# EAGLE design COUNT (EAGLE 7.2.0)
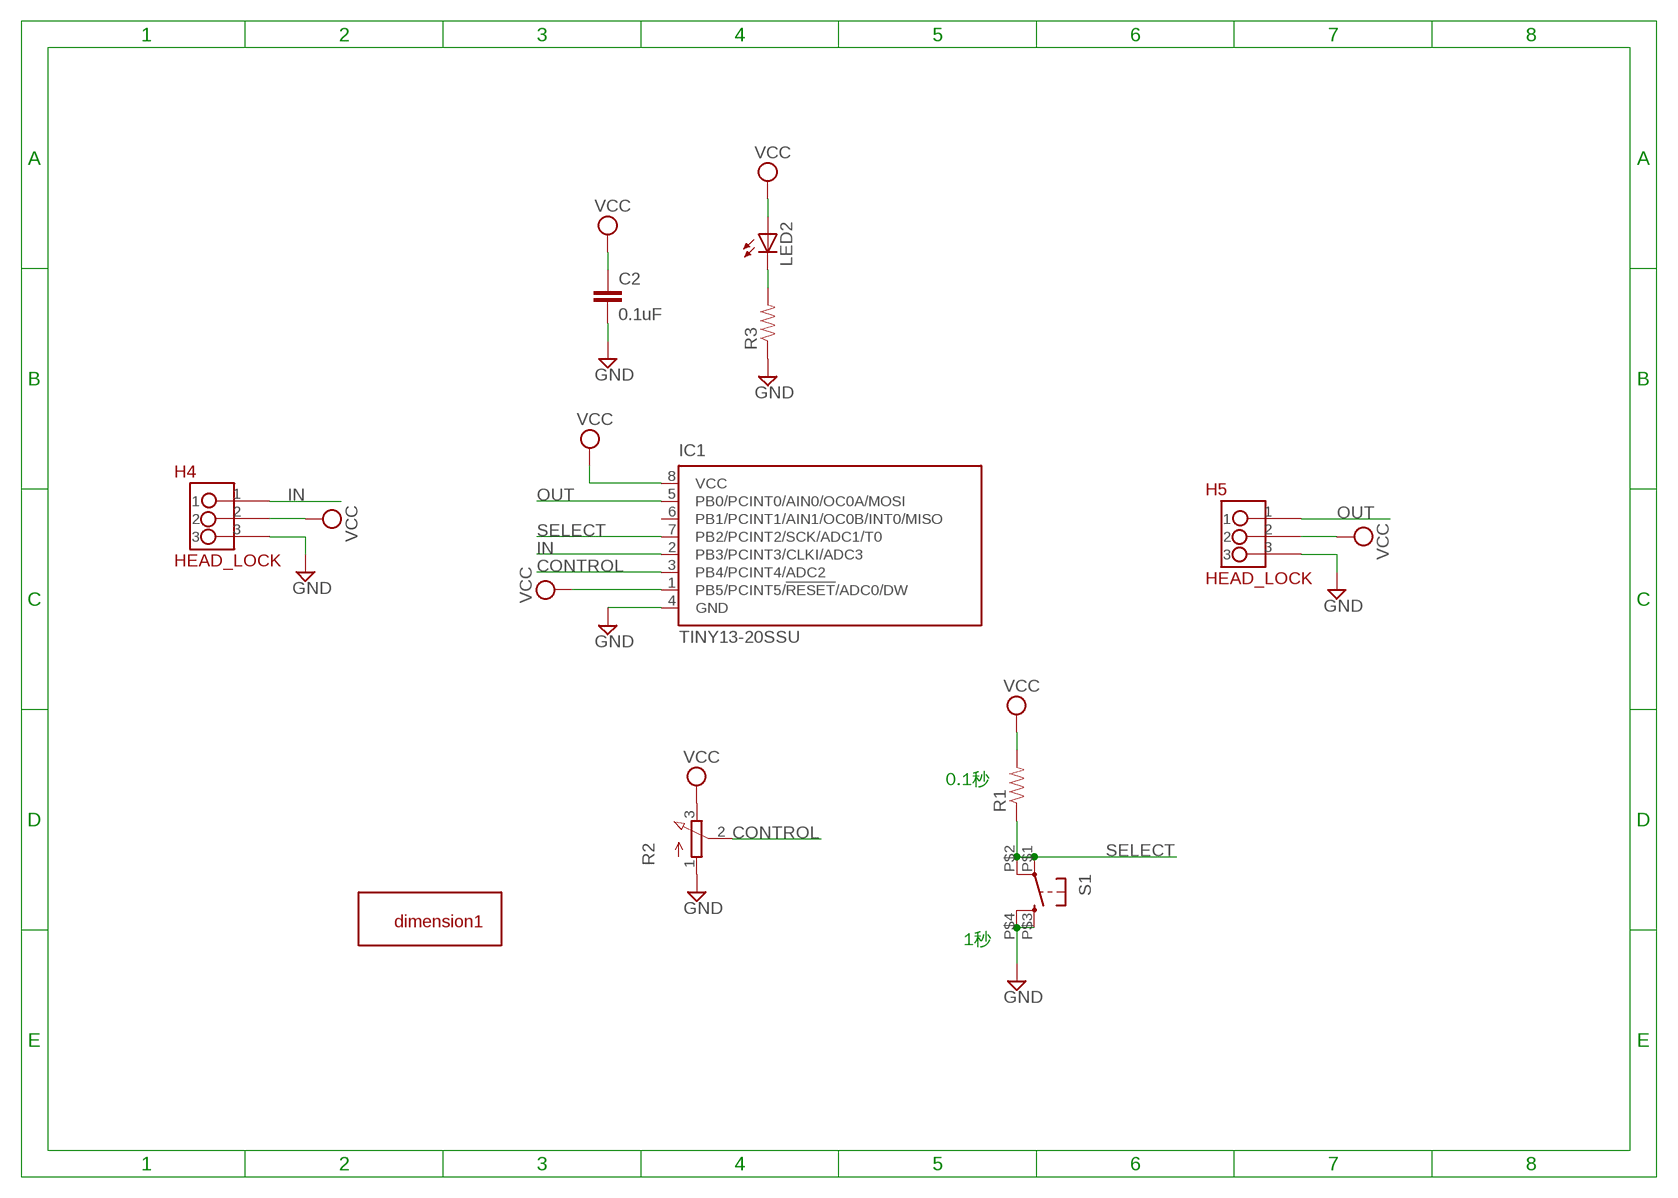
[diagram p0: schematic, sheet 1]

## Parts
C2  0.1uF  CAP0603-CAP  [0603-CAP]
H4  HEAD_LOCK  [HEAD_LOCK]
H5  HEAD_LOCK  [HEAD_LOCK]
IC1  TINY13-20SSU  [8S1]
LED2  LED_ESML0603  [LED_SML0603]
R1  RESISTOR0603-RES  [0603-RES]
R2  3RP/1610N  [3RP/1610N]
R3  0.27OHM-1/10W-1%(0603)  [0603-RES]
S1  TAC_SWITCHKSA_SEALED  [KSA_SEALED_TAC_SWITCH]
U$1  DIMENSION1  [DIMENSION1]

## Nets
CONTROL: IC1.3(PB4/PCINT4/ADC2) R2.2(S)
GND: C2.2 H4.3 H5.3 IC1.4(GND) R2.1(A) R3.1 S1.P$3 S1.P$4
IN: H4.1 IC1.2(PB3/PCINT3/CLKI/ADC3)
N$2: LED2.C R3.2
OUT: H5.1 IC1.5(PB0/PCINT0/AIN0/OC0A/MOSI)
SELECT: IC1.7(PB2/PCINT2/SCK/ADC1/T0) R1.1 S1.P$1 S1.P$2
VCC: C2.1 H4.2 H5.2 IC1.1(PB5/PCINT5/!RESET!/ADC0/DW) IC1.8(VCC) LED2.A R1.2 R2.3(E)
Unconnected: IC1.6(PB1/PCINT1/AIN1/OC0B/INT0/MISO)

## Notes on the sheet
- 0.1秒
- 1秒

## Library data of the parts
C2 = SparkFun-Passives:CAP: Capacitor Standard 0603 ceramic capacitor, and 0.1" leaded capacitor.
H4 H5 = HEAD_LOCK:HEAD_LOCK: 带锁的排座
IC1 = atmel:TINY13: 8-bit AVR Microcontroller with 1K Bytes In-System Programmable Flash Source: http://www.atmel.com/dyn/resources/prod_documents/2535S.pdf; MPN: ATTINY13-20SSU; OC_FARNELL: 1455133; OC_NEWARK: 58M3771
LED2 = eagle-ltspice:LED_E: LED Source: http://www.osram.convergy.de Source: www.luxeon.com Source: www.kingbright.com; SPICEMODEL: NONE; SPICEPREFIX: D; SPICETYPE: diode
R1 = SparkFun-Passives:RESISTOR: Resistor Basic schematic elements and footprints for 0603, 1206, and PTH resistors.
R2 = pot:3RP/1610N: 16mm Potentiometer one level Source: http://www.alphapotentiometers.net/html/16mm_pot_2.html
R3 = SparkFun-Resistors:0.27OHM-1/10W-1%(0603): RES-08787; PROD_ID: RES-08787
S1 = SparkFun-Retired:TAC_SWITCH: Momentary Switch Button commonly used for reset or general input. Spark Fun Electronics SKU : COM-00097 SMT- SWCH-08247
U$1 = Xmaker_yuhui:DIMENSION1

## Board
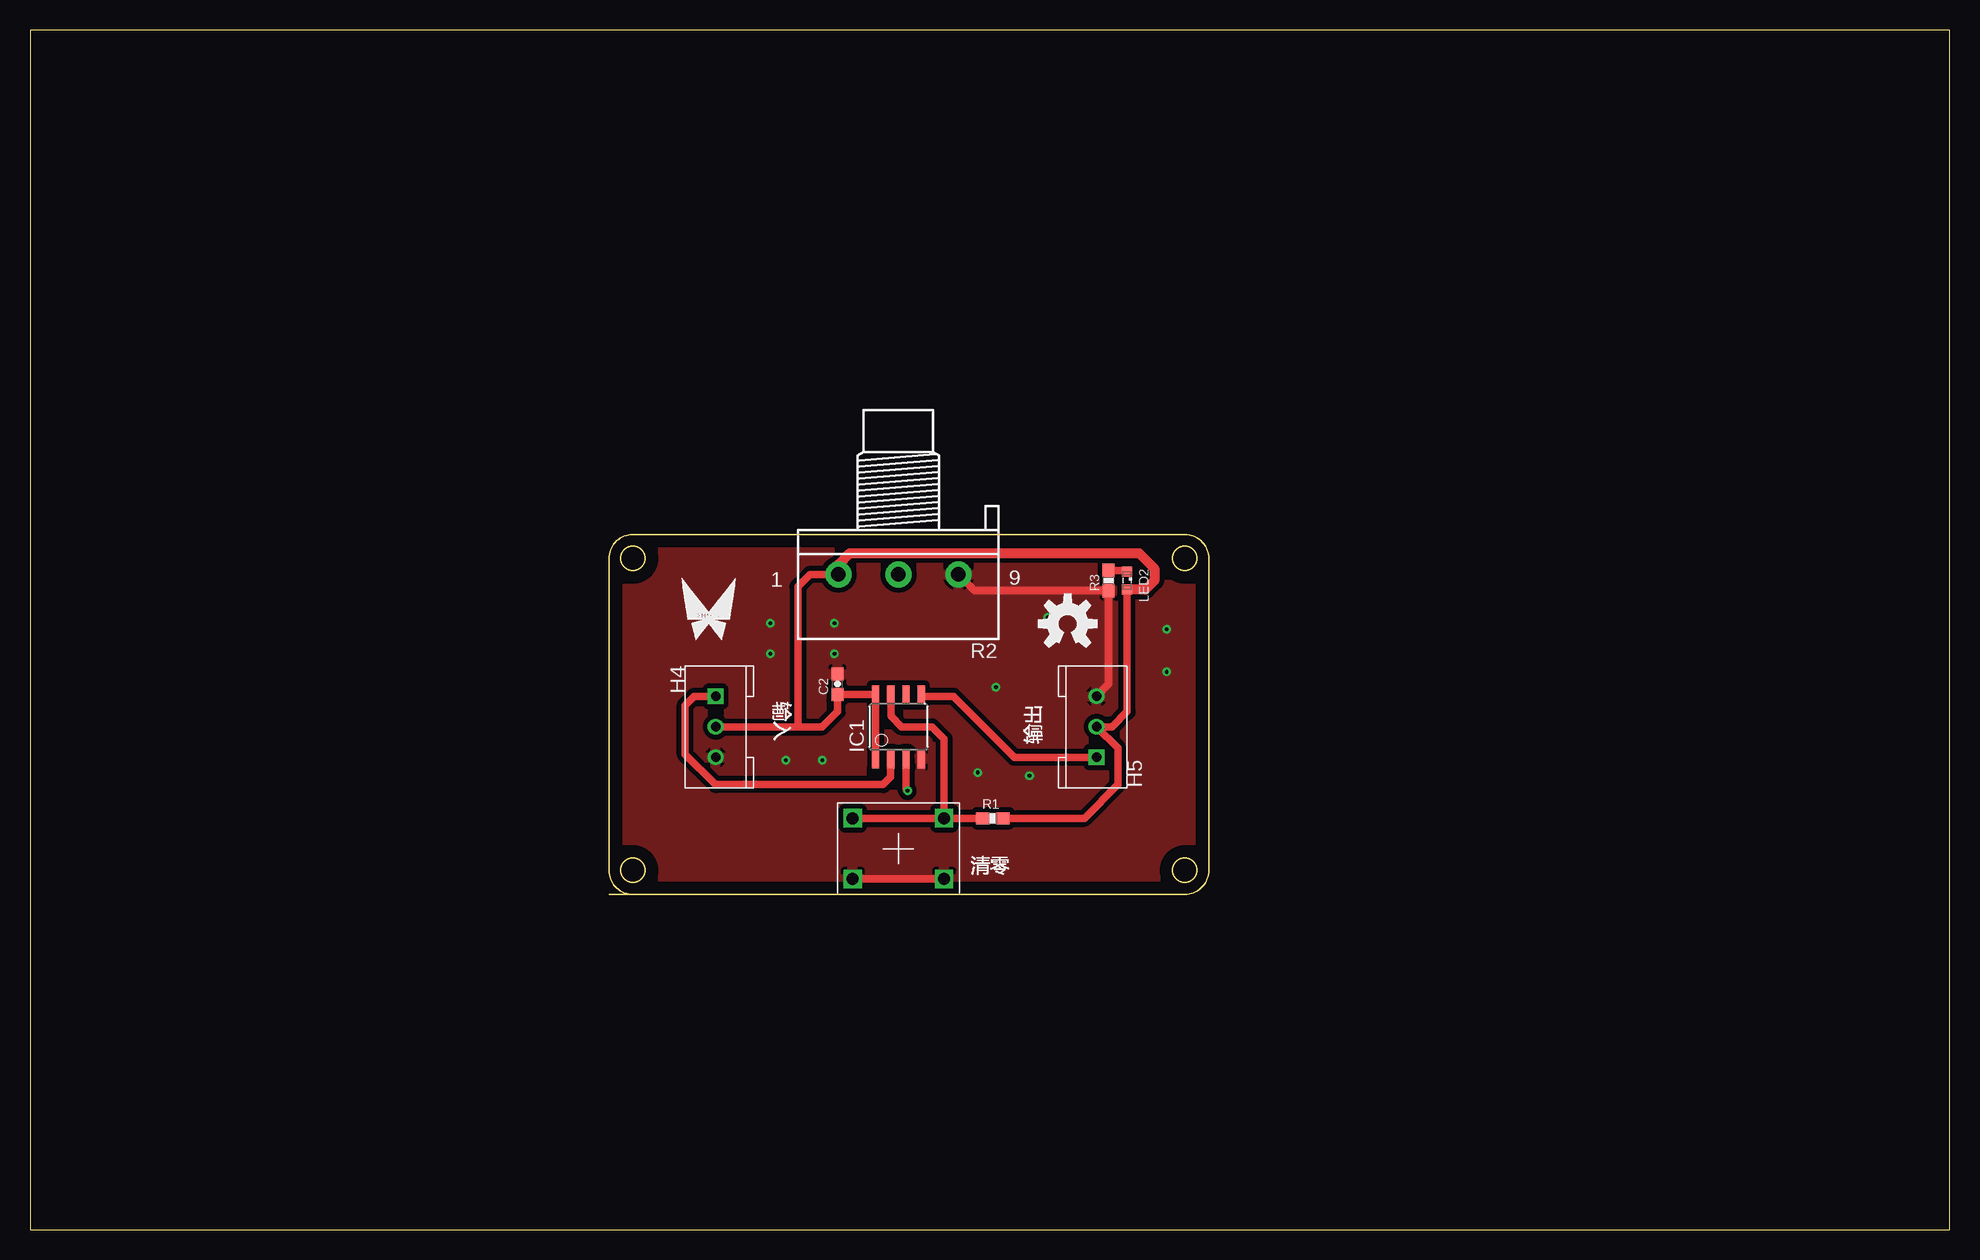
[diagram p1: board, top side]
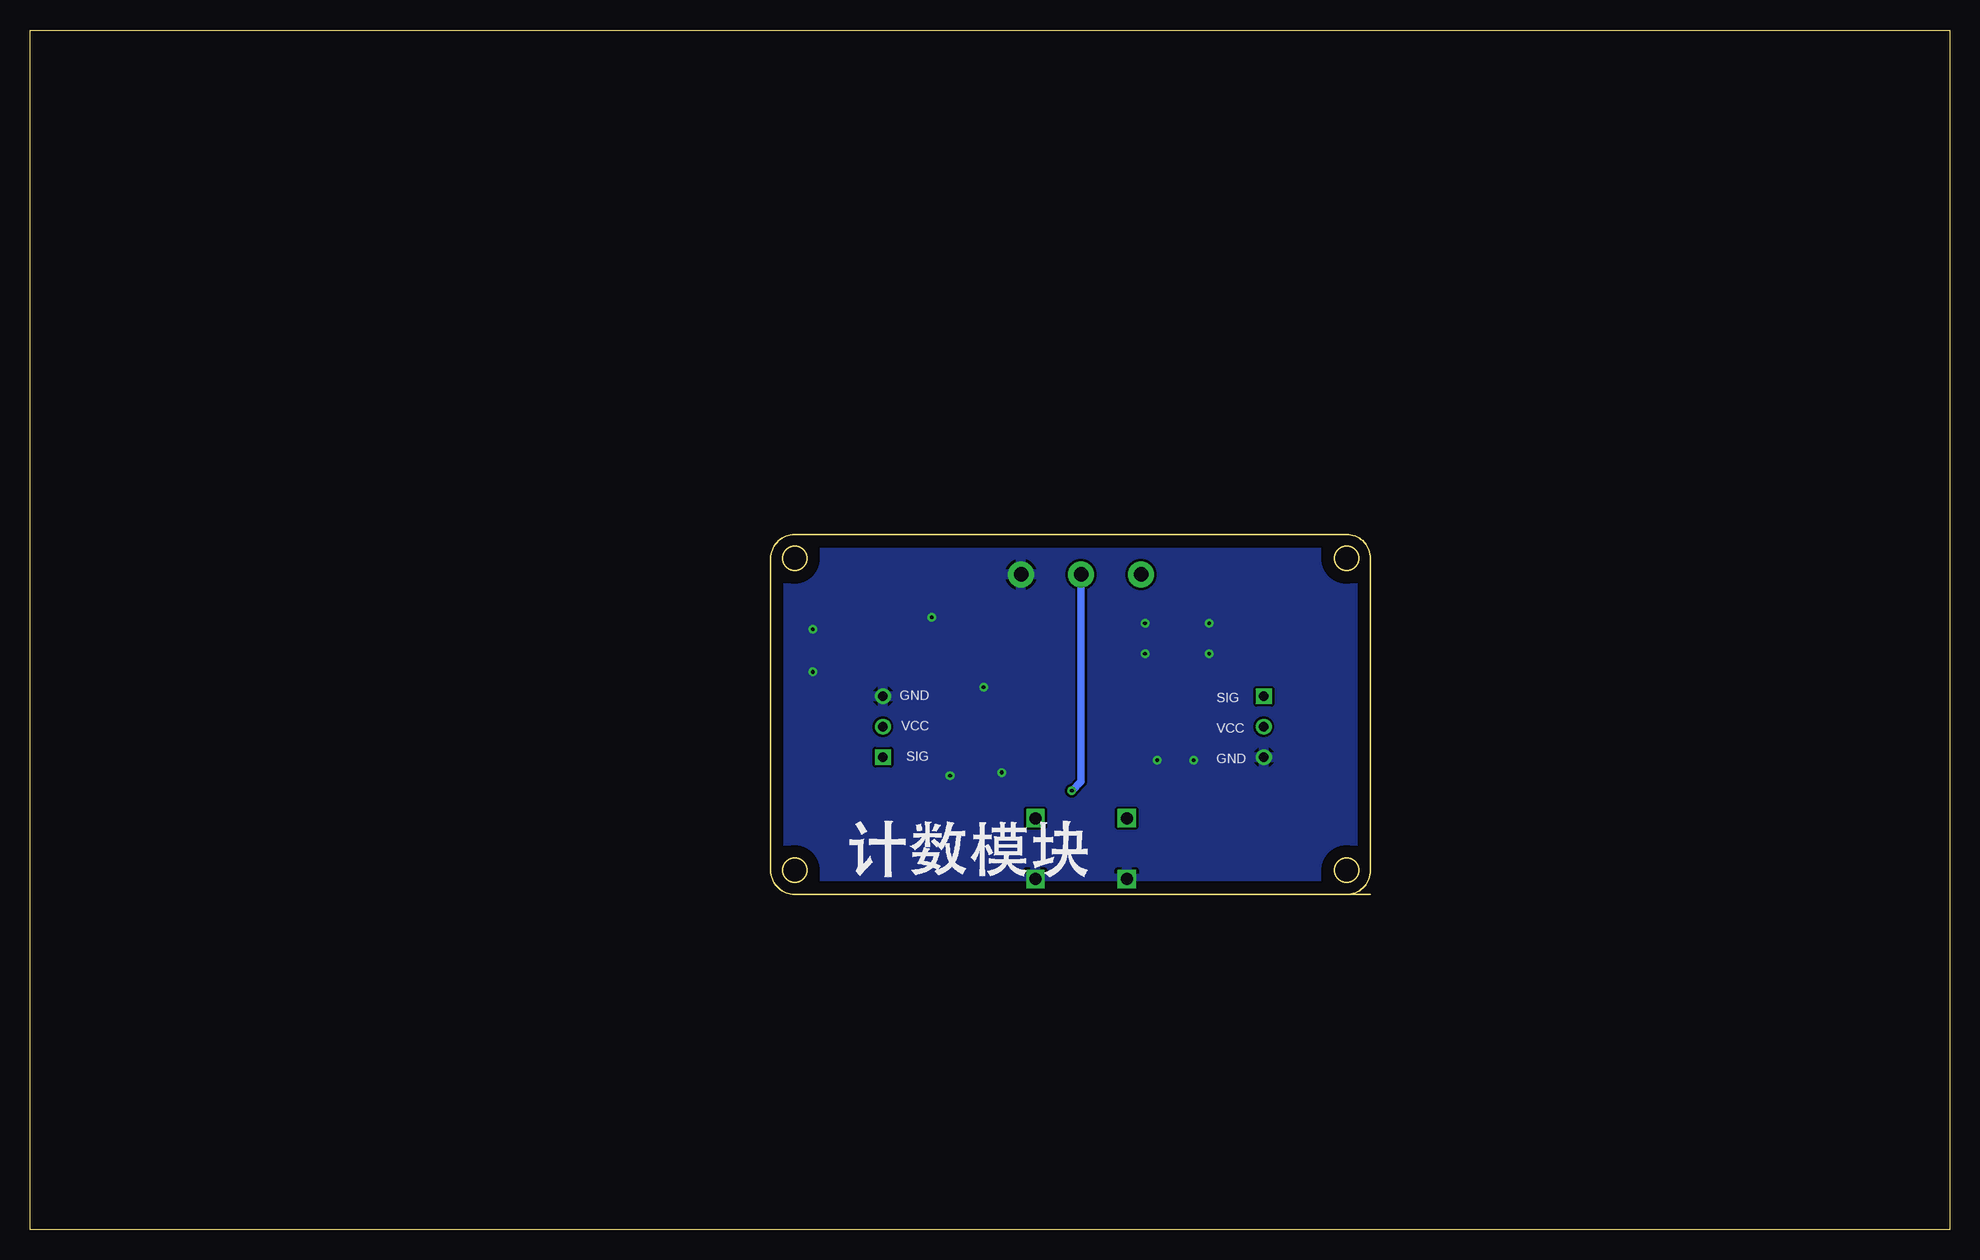
[diagram p2: board, bottom side, seen from below]

Size 160 x 100 mm. Coordinates in mm from the lower left corner, seen from the top.
Outline: 0,0 160,0 160,100 0,100 0,0
Copper layers (1*16): Top 0.035mm / dielectric 1.5mm / Bottom 0.035mm
Design rules "default": minimum track width 10mil, minimum drill 24mil, track to track 8mil, track to pad 8mil, pad to pad 8mil, via to via 8mil, smd to smd 8mil, copper to edge 40mil, drill to drill 8mil, minimum pad ring 10mil, minimum via ring 8mil, stop-mask expansion 4mil, vias tented up to drill 0mil, thermal gap 10mil

### Footprints (pad centres in the part's own frame; a part is rotated, then mirrored left to right if it is on the bottom)
0603-CAP = smd 1.1 x 1: 1 -0.85,0; 2 0.85,0
HEAD_LOCK = drill 0.8 square: 1 0,0 | drill 0.8: 2 2.54,0; 3 5.08,0
8S1 = smd 0.6 x 1.6: 1 -1.905,-2.654; 2 -0.645,-2.654; 3 0.625,-2.654; 4 1.895,-2.654; 5 1.905,2.654; 6 0.635,2.654; 7 -0.635,2.654; 8 -1.905,2.654
LED_SML0603 = smd 0.8 x 0.8: A 0.75,0; C -0.75,0
0603-RES = smd 1.1 x 1: 1 -0.85,0; 2 0.85,0
3RP/1610N = drill 1.2 pad 2.184: 1 -5,0; 2 0,0; 3 5,0
KSA_SEALED_TAC_SWITCH = drill 1 square: P$1 -3.81,2.54; P$2 3.81,2.54; P$3 -3.81,-2.54; P$4 3.81,-2.54

### Placement (x,y rotation side)
C2  67.31,45.47 90 top
H4  57.15,44.45 270 top
H5  88.9,39.37 90 top
IC1  72.39,41.91 0 top
LED2  91.44,54.1 270 top
R1  80.26,34.29 0 top
R2  72.39,54.61 180 top
R3  89.92,54.1 90 top
S1  72.39,31.75 0 top
U$1  48.26,27.94 0 top
U$2  [OSHW-LOGO-M]  86.49,50.5 0 top

### Tracks (layer width: path | path; a pad name or v marks a point on that pad's centre or on a via)
CONTROL  (via drill 0.3)
  Top 0.61: IC1.3 73.02,36.71 v73.15,36.58
  Bottom 0.61: R2.2 72.39,37.34 v73.15,36.58
GND  (via drill 0.3)
  Top 0.61: S1.P$4 S1.P$3 | H5.3 89.92,45.47 R3.1 78.75,53.25 R2.1
  other vias: 61.72,50.55 61.72,48.01 62.99,39.12 66.04,39.12 80.52,45.21 83.31,37.85 78.99,38.1 84.84,51.05 94.74,50.04 94.74,46.48 67.06,50.55 67.06,48.01
  pour Top (isolate 0.406): 47.24,58.93 100.58,58.93 100.58,23.88 47.24,23.88
  pour Bottom: 47.75,59.18 100.84,59.18 100.84,23.88 47.5,23.88 47.5,59.18
IN
  Top 0.61: IC1.2 71.75,37.71 71.12,37.08 57.15,37.08 54.61,39.62 54.61,43.69 55.37,44.45 H4.1
N$2
  Top 0.61: R3.2 91.34,54.95 LED2.C
OUT
  Top 0.61: H5.1 82.04,39.37 76.96,44.45 74.41,44.45 arc-90 IC1.5
SELECT
  Top 0.61: IC1.7 71.75,42.8 72.64,41.91 75.18,41.91 76.2,40.89 S1.P$2 | S1.P$1 S1.P$2 | R1.1 S1.P$2
VCC
  Top 0.61: IC1.1 IC1.8 arc90 70.43,44.62 C2.1 67.31,43.18 66.04,41.91 64.01,41.91 | LED2.A 91.44,43.18 90.17,41.91 H5.2 90.68,40.13 90.68,37.08 87.88,34.29 R1.2 | H4.2 64.01,41.91 | R2.3 65.02,54.61 64.01,53.59 64.01,41.91
  Top 0.813: R2.3 67.39,55.45 68.33,56.39 92.46,56.39 93.73,55.12 93.73,54.1 92.96,53.34 91.45,53.34 LED2.A

### Text on the board
tPlace: 1 | 9 | C:/Users/Xiangzi/Desktop/Ãû³Æ/XMAKER_PCB3.bmp | C:/Users/Xiangzi/Desktop/Ãû³Æ/¼ÆÊýģ¿é.bmp | C:/Users/Xiangzi/Desktop/Ãû³Æ/ÇåÁã.bmp | C:/Users/Xiangzi/Desktop/Ãû³Æ/Êä³ö.bmp | C:/Users/Xiangzi/Desktop/Ãû³Æ/ÊäÈë.bmp
bPlace: GND | SIG | VCC | VCC | SIG | GND